# Altium schematic sheet 电设原理图.SchDoc
size A4
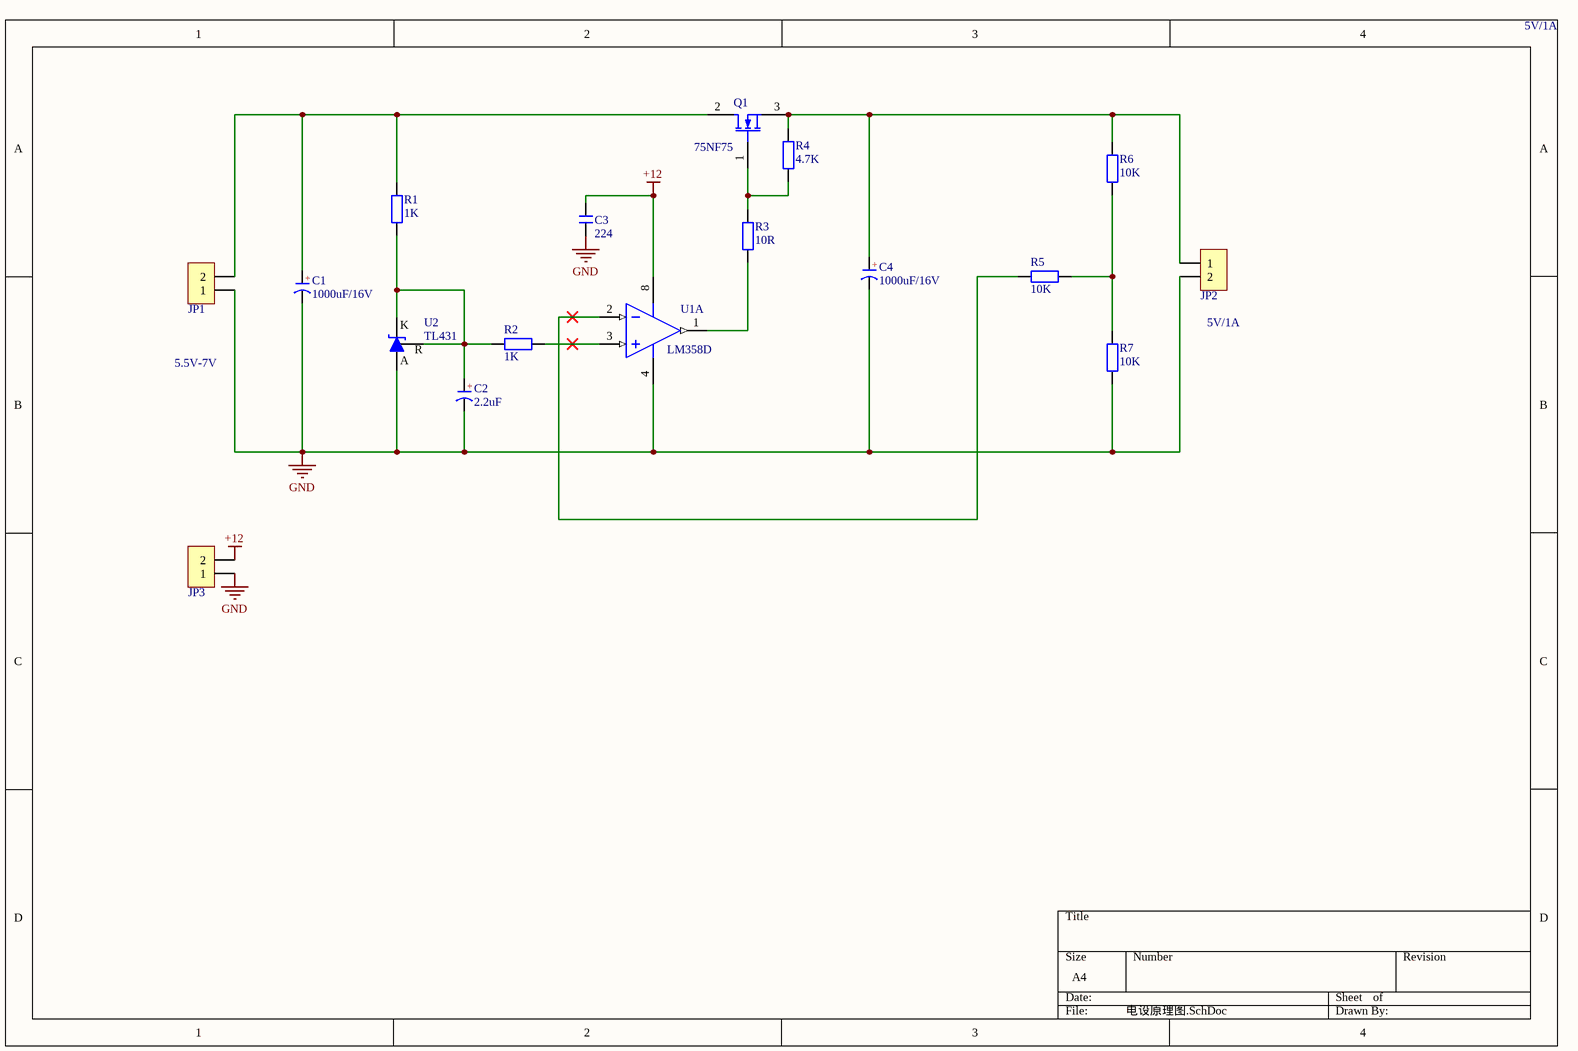
[diagram p0: 电设原理图.SchDoc]

## Parts
C1  1000uF/16V  [CS 3.5*8*11.5 - R]
C2  2.2uF  [CS 2.0*5*8 - C]
C3  224  [CC 2.2*5]
C4  1000uF/16V  [CS 3.5*8*11.5 - R]
JP1  HDR-1X2  [KF128-5.08-2P]  (value not drawn)
JP2  HDR-1X2  [KF128-5.08-2P]  (value not drawn)
JP3  HDR-1X2  [KF128-5.08-2P]  (value not drawn)
Q1  75NF75  [TO220A]
R1  1K  [R 0805-HP_M]
R2  1K  [R 0805-HP_M]
R3  10R  [R 0805-HP_M]
R4  4.7K  [R 0805-HP_M]
R5  10K  [R 0805-HP_M]
R6  10K  [R 0805-HP_M]
R7  10K  [R 0805-HP_M]
U1  LM358D  [DIP-8]  (part A of 2)
U2  TL431  [TO92A]

## Nets
+12: C3.2 JP3.2 U1.8(V+)
GND: C1.2(K) C2.2(K) C3.1 C4.2(K) JP1.1 JP2.2 JP3.1 R7.2 U1.4(V-) U2.2(A)
NetC1_1: C1.1(A) JP1.2 Q1.2 R1.2
NetC2_1: C2.1(A) R1.1 R2.2 U2.1(R) U2.3(K)
NetC4_1: C4.1(A) JP2.1 Q1.3 R4.2 R6.1
NetQ1_1: Q1.1 R3.2 R4.1
NetR2_1: R2.1 U1.3(IN1+)
NetR3_1: R3.1 U1.1(OUT1)
NetR5_1: R5.1 U1.2(IN1-)
NetR5_2: R5.2 R6.2 R7.1

## Notes on the sheet
- 5V/1A
- (near JP2) 5V/1A
- 5.5V-7V
- (in symbol CS) +

## Library data of the parts
C1 C2 C4 = CS: 直插固态电容; 优秀评价可免费更新: 联系淘宝ID：黄晶宝石，获取更新版封装库; 卖家免费技术支持，联系售后: 唯一出售店铺网址https://shop463601444.taobao.com; 本封装库来自淘宝卖家 ID：黄晶宝石: 其他店铺购入均为盗版，请立即申请退款; BOM名称: 直插固态电容
C3 = C-MLCC: 独石电容; 优秀评价可免费更新: 联系淘宝ID：黄晶宝石，获取更新版封装库; 卖家免费技术支持，联系售后: 唯一出售店铺网址https://shop463601444.taobao.com; 本封装库来自淘宝卖家 ID：黄晶宝石: 其他店铺购入均为盗版，请立即申请退款; BOM名称: 独石电容
JP1-JP3 = Header 2: 2P接插件; 版权归属: 封装库来自淘宝 ID：黄晶宝石; 优秀评价可免费更新: 联系淘宝ID：黄晶宝石，获取更新版封装库; 卖家免费技术支持，联系售后: 唯一出售店铺网址https://shop463601444.taobao.com; BOM名称: 2P接插件
Q1 = RUE002N02: 低功耗MOSFET; 卖家免费技术支持，联系售后: 唯一出售店铺网址https://shop463601444.taobao.com; 封装库来自淘宝卖家 ID：黄晶宝石: 其他店铺购入均为假冒，请申请退款，本店现金奖励
R1-R7 = R-S: 色环电阻; 优秀评价可免费更新: 联系淘宝ID：黄晶宝石，获取更新版封装库; 卖家免费技术支持，联系售后: 唯一出售店铺网址https://shop463601444.taobao.com; 本封装库来自淘宝卖家 ID：黄晶宝石: 其他店铺购入均为盗版，请立即申请退款; BOM名称: 色环电阻
U1 = LM358_NSC: Fast Settling Dual Operational Amplifier; 卖家免费技术支持，联系售后: 唯一出售店铺网址https://shop463601444.taobao.com; 封装库来自淘宝卖家 ID：黄晶宝石: 其他店铺购入均为假冒，请立即申请退款，本店现金奖励; 优秀评价可免费更新封装库: 联系淘宝ID：黄晶宝石，获取更新版封装库
U2 = TL431-ID: 可调基准稳压芯片; 优秀评价可免费更新: 联系淘宝ID：黄晶宝石，获取更新版封装库; 卖家免费技术支持，联系售后: 唯一出售店铺网址https://shop463601444.taobao.com; 封装库来自淘宝卖家 ID：黄晶宝石: 其他店铺购入均为假冒，请立即申请退款，本店奖励2~5元现金; BOM名称: 可调基准稳压芯片